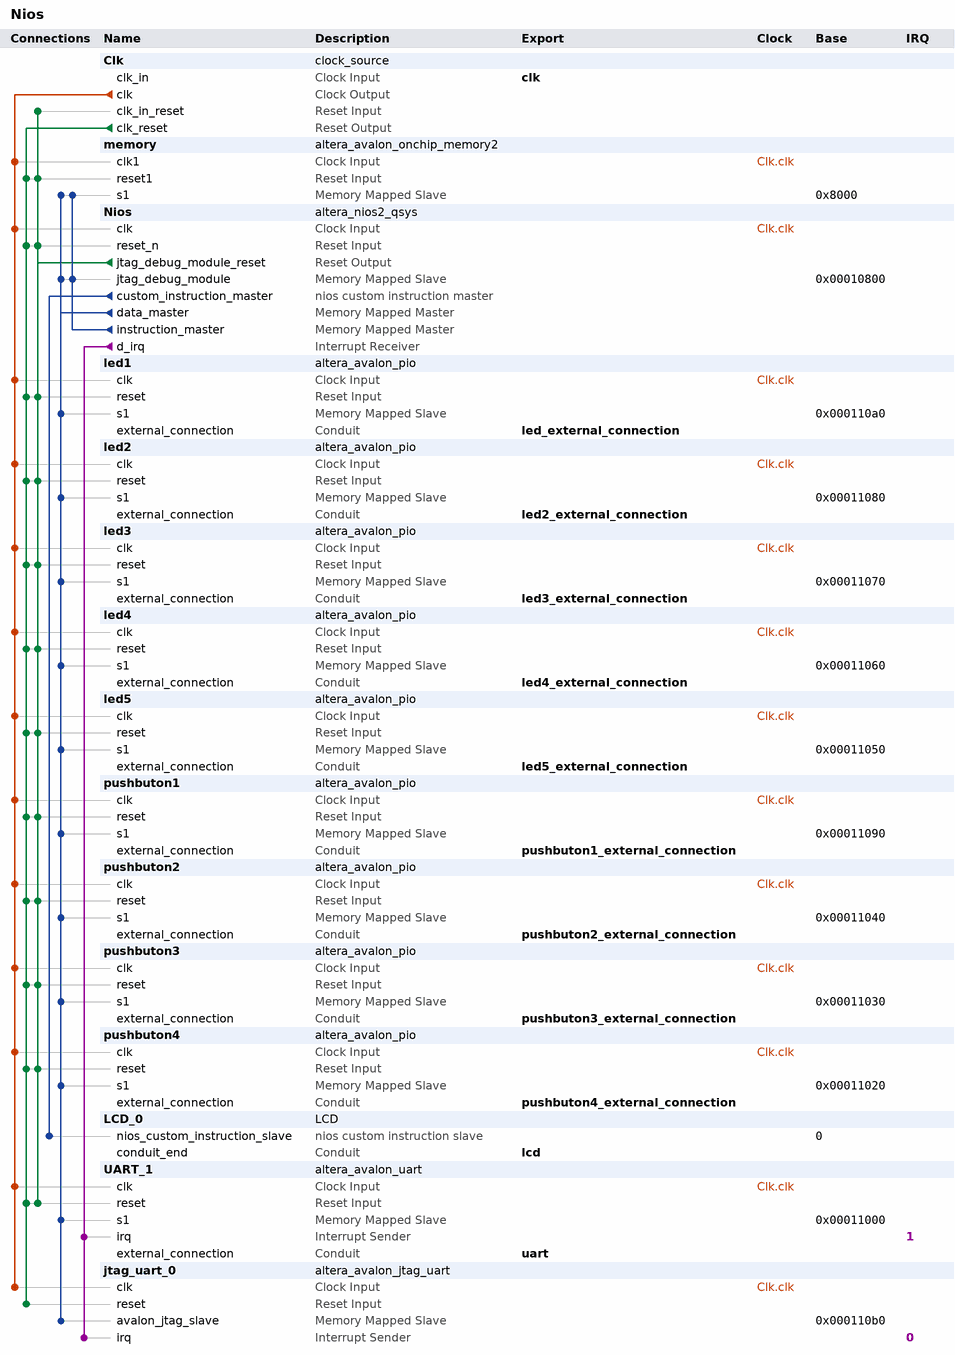
[diagram p0: system contents]
# Platform Designer (Qsys) system Nios, Cyclone IV E EP4CE6E22C8
# Parameters at their usual value, and those the tool derives, are not listed.
package require -exact qsys 13.1
create_system Nios
set_project_property DEVICE_FAMILY {Cyclone IV E}
set_project_property DEVICE EP4CE6E22C8

add_instance Clk clock_source 13.1
set_instance_parameter_value Clk clockFrequency 50000000

add_instance memory altera_avalon_onchip_memory2 13.1
set_instance_parameter_value memory dataWidth 32
set_instance_parameter_value memory dualPort false
set_instance_parameter_value memory initMemContent true
set_instance_parameter_value memory initializationFileName onchip_mem.hex
set_instance_parameter_value memory memorySize 20480

add_instance Nios altera_nios2_qsys 13.1
set_instance_parameter_value Nios resetSlave memory.s1
set_instance_parameter_value Nios mmu_TLBMissExcSlave None
set_instance_parameter_value Nios exceptionSlave memory.s1
set_instance_parameter_value Nios breakSlave Nios.jtag_debug_module
set_instance_parameter_value Nios muldiv_multiplierType NoneSmall
set_instance_parameter_value Nios impl Tiny
set_instance_parameter_value Nios icache_size 4096

add_instance led1 altera_avalon_pio 13.1
set_instance_parameter_value led1 direction Output
set_instance_parameter_value led1 width 1

add_instance led2 altera_avalon_pio 13.1
set_instance_parameter_value led2 direction Output
set_instance_parameter_value led2 width 1

add_instance led3 altera_avalon_pio 13.1
set_instance_parameter_value led3 direction Output
set_instance_parameter_value led3 width 1

add_instance led4 altera_avalon_pio 13.1
set_instance_parameter_value led4 direction Output
set_instance_parameter_value led4 width 1

add_instance led5 altera_avalon_pio 13.1
set_instance_parameter_value led5 direction Output
set_instance_parameter_value led5 width 1

add_instance pushbuton1 altera_avalon_pio 13.1
set_instance_parameter_value pushbuton1 direction Input
set_instance_parameter_value pushbuton1 width 1

add_instance pushbuton2 altera_avalon_pio 13.1
set_instance_parameter_value pushbuton2 direction Input
set_instance_parameter_value pushbuton2 width 1

add_instance pushbuton3 altera_avalon_pio 13.1
set_instance_parameter_value pushbuton3 direction Input
set_instance_parameter_value pushbuton3 width 1

add_instance pushbuton4 altera_avalon_pio 13.1
set_instance_parameter_value pushbuton4 direction Input
set_instance_parameter_value pushbuton4 width 1

add_instance LCD_0 LCD 1.0

add_instance UART_1 altera_avalon_uart 13.1
set_instance_parameter_value UART_1 baud 115200
set_instance_parameter_value UART_1 dataBits 8
set_instance_parameter_value UART_1 fixedBaud true
set_instance_parameter_value UART_1 parity NONE
set_instance_parameter_value UART_1 stopBits 1

add_instance jtag_uart_0 altera_avalon_jtag_uart 13.1
set_instance_parameter_value jtag_uart_0 simInteractiveOptions NO_INTERACTIVE_WINDOWS

# connections
add_connection Clk.clk jtag_uart_0.clk clock
add_connection Clk.clk led1.clk clock
add_connection Clk.clk led2.clk clock
add_connection Clk.clk led3.clk clock
add_connection Clk.clk led4.clk clock
add_connection Clk.clk led5.clk clock
add_connection Clk.clk memory.clk1 clock
add_connection Clk.clk Nios.clk clock
add_connection Clk.clk pushbuton1.clk clock
add_connection Clk.clk pushbuton2.clk clock
add_connection Clk.clk pushbuton3.clk clock
add_connection Clk.clk pushbuton4.clk clock
add_connection Clk.clk UART_1.clk clock
add_connection Clk.clk_reset jtag_uart_0.reset reset
add_connection Clk.clk_reset led1.reset reset
add_connection Clk.clk_reset led2.reset reset
add_connection Clk.clk_reset led3.reset reset
add_connection Clk.clk_reset led4.reset reset
add_connection Clk.clk_reset led5.reset reset
add_connection Clk.clk_reset memory.reset1 reset
add_connection Clk.clk_reset Nios.reset_n reset
add_connection Clk.clk_reset pushbuton1.reset reset
add_connection Clk.clk_reset pushbuton2.reset reset
add_connection Clk.clk_reset pushbuton3.reset reset
add_connection Clk.clk_reset pushbuton4.reset reset
add_connection Clk.clk_reset UART_1.reset reset
add_connection Nios.jtag_debug_module_reset Clk.clk_in_reset reset
add_connection Nios.jtag_debug_module_reset led1.reset reset
add_connection Nios.jtag_debug_module_reset led2.reset reset
add_connection Nios.jtag_debug_module_reset led3.reset reset
add_connection Nios.jtag_debug_module_reset led4.reset reset
add_connection Nios.jtag_debug_module_reset led5.reset reset
add_connection Nios.jtag_debug_module_reset memory.reset1 reset
add_connection Nios.jtag_debug_module_reset Nios.reset_n reset
add_connection Nios.jtag_debug_module_reset pushbuton1.reset reset
add_connection Nios.jtag_debug_module_reset pushbuton2.reset reset
add_connection Nios.jtag_debug_module_reset pushbuton3.reset reset
add_connection Nios.jtag_debug_module_reset pushbuton4.reset reset
add_connection Nios.jtag_debug_module_reset UART_1.reset reset
add_connection Nios.data_master jtag_uart_0.avalon_jtag_slave avalon
set_connection_parameter_value Nios.data_master/jtag_uart_0.avalon_jtag_slave baseAddress 0x000110b0
add_connection Nios.data_master led1.s1 avalon
set_connection_parameter_value Nios.data_master/led1.s1 baseAddress 0x000110a0
add_connection Nios.data_master led2.s1 avalon
set_connection_parameter_value Nios.data_master/led2.s1 baseAddress 0x00011080
add_connection Nios.data_master led3.s1 avalon
set_connection_parameter_value Nios.data_master/led3.s1 baseAddress 0x00011070
add_connection Nios.data_master led4.s1 avalon
set_connection_parameter_value Nios.data_master/led4.s1 baseAddress 0x00011060
add_connection Nios.data_master led5.s1 avalon
set_connection_parameter_value Nios.data_master/led5.s1 baseAddress 0x00011050
add_connection Nios.data_master memory.s1 avalon
set_connection_parameter_value Nios.data_master/memory.s1 baseAddress 0x8000
add_connection Nios.data_master Nios.jtag_debug_module avalon
set_connection_parameter_value Nios.data_master/Nios.jtag_debug_module baseAddress 0x00010800
add_connection Nios.data_master pushbuton1.s1 avalon
set_connection_parameter_value Nios.data_master/pushbuton1.s1 baseAddress 0x00011090
add_connection Nios.data_master pushbuton2.s1 avalon
set_connection_parameter_value Nios.data_master/pushbuton2.s1 baseAddress 0x00011040
add_connection Nios.data_master pushbuton3.s1 avalon
set_connection_parameter_value Nios.data_master/pushbuton3.s1 baseAddress 0x00011030
add_connection Nios.data_master pushbuton4.s1 avalon
set_connection_parameter_value Nios.data_master/pushbuton4.s1 baseAddress 0x00011020
add_connection Nios.data_master UART_1.s1 avalon
set_connection_parameter_value Nios.data_master/UART_1.s1 baseAddress 0x00011000
add_connection Nios.instruction_master memory.s1 avalon
set_connection_parameter_value Nios.instruction_master/memory.s1 baseAddress 0x8000
add_connection Nios.instruction_master Nios.jtag_debug_module avalon
set_connection_parameter_value Nios.instruction_master/Nios.jtag_debug_module baseAddress 0x00010800
add_connection Nios.d_irq jtag_uart_0.irq interrupt
set_connection_parameter_value Nios.d_irq/jtag_uart_0.irq irqNumber 0
add_connection Nios.d_irq UART_1.irq interrupt
set_connection_parameter_value Nios.d_irq/UART_1.irq irqNumber 1
add_connection Nios.custom_instruction_master LCD_0.nios_custom_instruction_slave nios_custom_instruction
set_connection_parameter_value Nios.custom_instruction_master/LCD_0.nios_custom_instruction_slave CIName lcd_0
set_connection_parameter_value Nios.custom_instruction_master/LCD_0.nios_custom_instruction_slave baseAddress 0

# exported interfaces
add_interface clk clock sink
set_interface_property clk EXPORT_OF Clk.clk_in
add_interface led_external_connection conduit end
set_interface_property led_external_connection EXPORT_OF led1.external_connection
add_interface pushbuton1_external_connection conduit end
set_interface_property pushbuton1_external_connection EXPORT_OF pushbuton1.external_connection
add_interface led2_external_connection conduit end
set_interface_property led2_external_connection EXPORT_OF led2.external_connection
add_interface led3_external_connection conduit end
set_interface_property led3_external_connection EXPORT_OF led3.external_connection
add_interface led4_external_connection conduit end
set_interface_property led4_external_connection EXPORT_OF led4.external_connection
add_interface led5_external_connection conduit end
set_interface_property led5_external_connection EXPORT_OF led5.external_connection
add_interface pushbuton2_external_connection conduit end
set_interface_property pushbuton2_external_connection EXPORT_OF pushbuton2.external_connection
add_interface pushbuton3_external_connection conduit end
set_interface_property pushbuton3_external_connection EXPORT_OF pushbuton3.external_connection
add_interface pushbuton4_external_connection conduit end
set_interface_property pushbuton4_external_connection EXPORT_OF pushbuton4.external_connection
add_interface lcd conduit end
set_interface_property lcd EXPORT_OF LCD_0.conduit_end
add_interface uart conduit end
set_interface_property uart EXPORT_OF UART_1.external_connection

set_interconnect_requirement {$system} qsys_mm.clockCrossingAdapter HANDSHAKE
set_interconnect_requirement {$system} qsys_mm.maxAdditionalLatency 1
set_interconnect_requirement {$system} qsys_mm.insertDefaultSlave false

save_system Nios.qsys
